# Altium schematic sheet pwrmngmnt.SchDoc
size A3; SheetNumber: 1; SheetTotal: 2
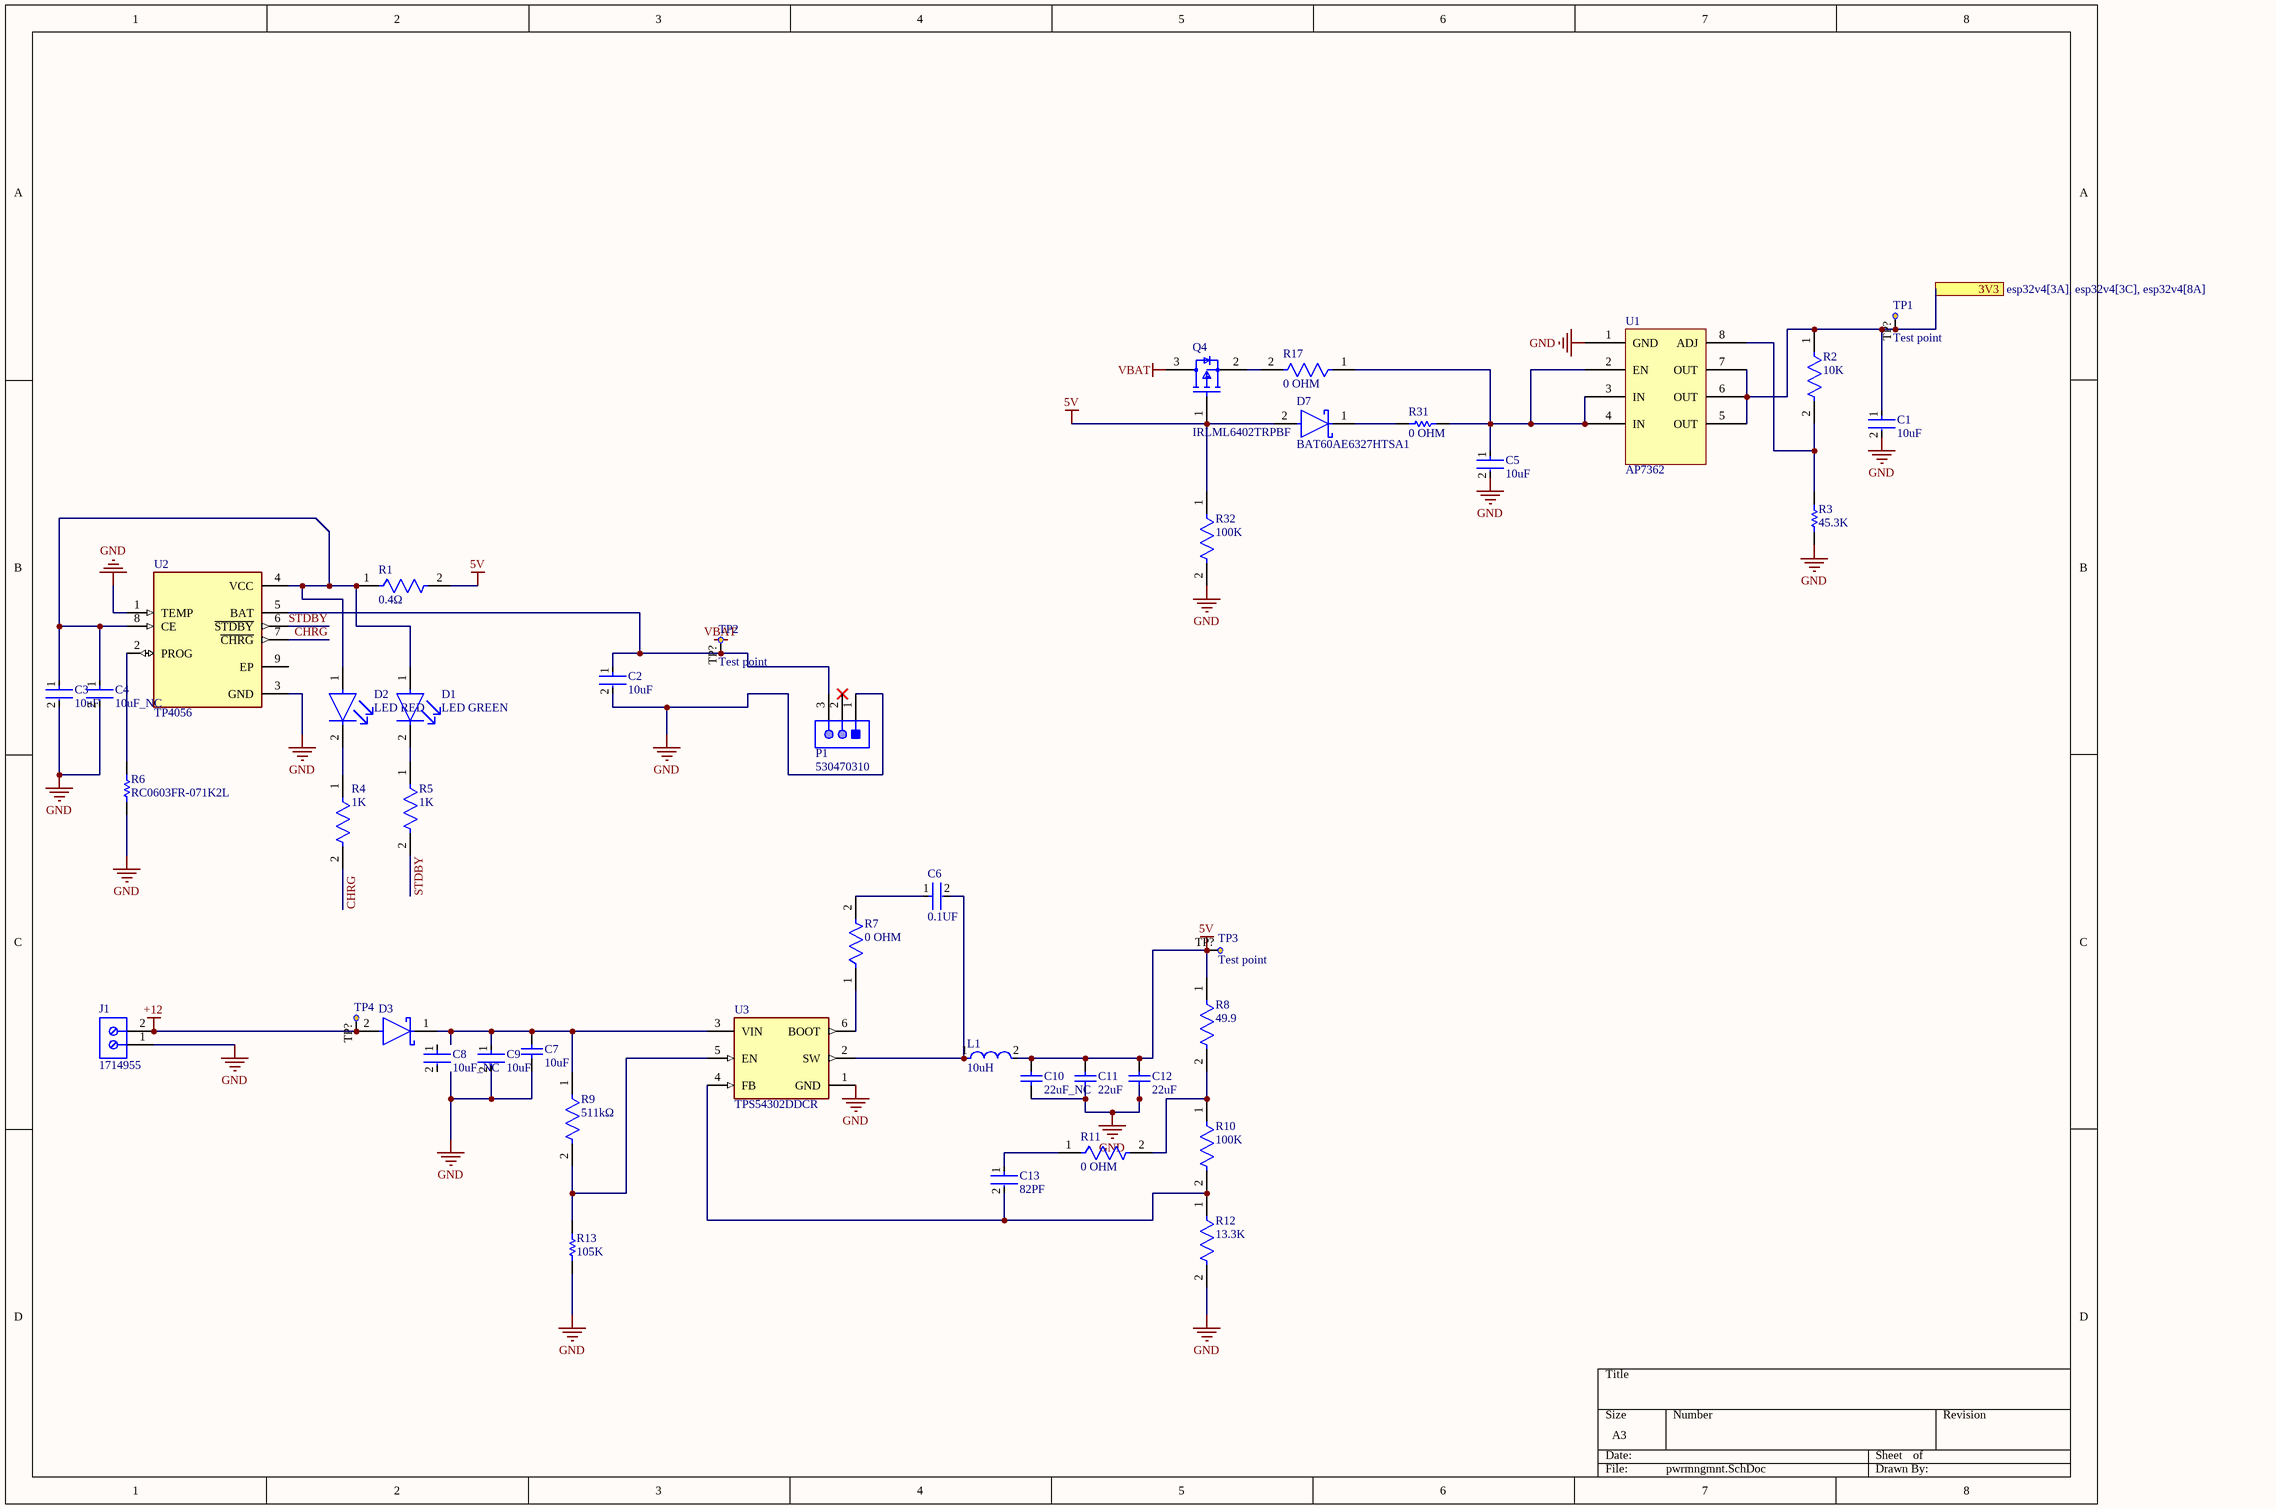
[diagram p0: pwrmngmnt.SchDoc]

## Parts
C1  10uF  [FP-GRM21B-0_1-IPC_C]
C2  10uF  [FP-1210-L_3_3_0_4-W_2_5_0-IPC_B]
C3  10uF  [FP-GRM21B-0_1-IPC_C]
C4  10uF_NC  [FP-GRM21B-0_1-IPC_C]
C5  10uF  [FP-GRM21B-0_1-IPC_C]
C6  0.1UF  [FP-CC0805-0_85-MFG]
C7  10uF  [CAPC1210(3225)280_L]
C8  10uF_NC  [FP-GRM21B-0_1-IPC_C]
C9  10uF  [FP-GRM21B-0_1-IPC_C]
C10  22uF_NC  [CAPC1210(3225)230_L]
C11  22uF  [CAPC1210(3225)230_L]
C12  22uF  [CAPC1210(3225)230_L]
C13  82PF  [FP-C0603C-CF-MFG]
D1  LED GREEN  [FP-APT2012MGC-MFG]
D2  LED RED  [FP-AP2012EC-MFG]
D3  SS34-E3/57T  [FP-95402-MFG]  (value not drawn)
D7  BAT60AE6327HTSA1  [FP-PG-SOD323-2-IPC_C]
J1  1714955  [PHOE-1714955_V]
L1  10uH  [FP-CB3225-IPC_A]
P1  530470310  [MOLX-530470310_V]
Q4  IRLML6402TRPBF  [FP-Micro3-MFG]
R1  0.4Ω  [FP-CSR1206-IPC_C]
R2  10K  [FP-RT0603-MFG]
R3  45.3K  [RESC2013X60X35NL10T20]
R4  1K  [FP-RT0603-MFG]
R5  1K  [FP-RT0603-MFG]
R6  RC0603FR-071K2L  [RESC1608X55X25LL10T15]
R7  0 OHM  [FP-RMCF0805-MFG]
R8  49.9  [FP-CPF0603-MFG]
R9  511kΩ  [FP-CRCW0805-e3-IPC_B]
R10  100K  [FP-RT0402-MFG]
R11  0 OHM  [FP-RMCF0805-MFG]
R12  13.3K  [FP-ERJ3EK-MFG]
R13  105K  [RESC2013X60X35LL10T20]
R17  0 OHM  [FP-RMCF0805-MFG]
R31  0 OHM  [RESC1608X55X25ML10T15]
R32  100K  [FP-RT0402-MFG]
TP1  Test point  [Test_Point]
TP2  Test point  [Test_Point]
TP3  Test point  [Test_Point]
TP4  Test point  [Test_Point]  (value not drawn)
U1  AP7362  [SOIC127P600X163-9N]
U2  TP4056  [SOP127P600X175-9N]
U3  TPS54302DDCR  [FP-DDC0006A-MFG]

## Ports
3V3 (see esp32v4[3A], esp32v4[3C], esp32v4[8A])

## Nets
5V: C10.1 C11.1 C12.1 D7.2(A) L1.2 Q4.1(G) R1.2 R8.1 R32.1 TP3.TP?(Test_point)
+12: D3.2(A) J1.2 TP4.TP?(Test_point)
GND: C1.2 C2.2 C3.2 C4.2 C5.2 C7.2 C9.2 C10.2 C11.2 C12.2 J1.1 P1.1 R3.2 R6.2 R12.2 R13.1 R32.2 U1.1(GND) U2.1(TEMP) U2.3(GND) U3.1(GND)
VBAT: C2.1 P1.3 Q4.3(D) TP2.TP?(Test_point) U2.5(BAT)
3V3: C1.1 R2.1 TP1.TP?(Test_point) U1.5(OUT) U1.6(OUT) U1.7(OUT) ; port 3V3
CHRG: R4.2 U2.7(~{CHRG})
STDBY: R5.2 U2.6(~{STDBY})
NetC3_1: C3.1 C4.1 D1.1(A) D2.1(A) R1.1 U2.4(VCC) U2.8(CE)
NetC5_1: C5.1 R17.1 R31.2 U1.2(EN) U1.3(IN) U1.4(IN)
NetC6_1: C6.1 R7.2
NetC6_2: C6.2 L1.1 U3.2(SW)
NetC7_1: C7.1 C9.1 D3.1(C) R9.1 U3.3(VIN)
NetC13_1: C13.1 R11.1
NetC13_2: C13.2 R10.2 R12.1 U3.4(FB)
NetD1_2: D1.2(C) R5.1
NetD2_2: D2.2(C) R4.1
NetD7_1: D7.1(C) R31.1
NetQ4_2: Q4.2(S) R17.2
NetR2_2: R2.2 R3.1 U1.8(ADJ)
NetR6_1: R6.1 U2.2(PROG)
NetR7_1: R7.1 U3.6(BOOT)
NetR8_2: R8.2 R10.1 R11.2
NetR9_2: R9.2 R13.2 U3.5(EN)

Not connected (* = marked no-connect by the designer): C8 1 2; P1 2*; U2 9(EP)

## Library data of the parts
C1 C3-C5 C8 C9 = CMP-2007-03453-2: Chip Multilayer Ceramic Capacitors for General Purpose, 0805, 10uF, X5R, 15%, 10%, 16V; Radiation Hardening: No; Thickness: 0.053inch; Voltage Rating (DC): 16V; Lead Free: Lead Free; Package Quantity: 1; Width: 1.25mm; Case Code (Imperial): 0805; Depth: 1.25mm; Packaging: Tape and Reel; Dielectric: X5R; Max Operating Temperature: 85°C; Tolerance: 10%; Voltage Rating: 16V; Voltage: 16V; Capacitance: 10uF; Height: 1.25mm; Case Code (Metric): 2012; Material: Ceramic; Mount: Surface Mount; Case/Package: 0805; REACH SVHC: No SVHC; Length: 2mm; Min Operating Temperature: -55°C; Termination: SMD/SMT; Value: 10uF
C2 = CMP-2000-05480-2: General Purpose Ceramic Capacitor, 1210, 10uF, 10%, X7R, 15%, 50V; Thickness: 0.11inch; Capacitance: 10uF; Case Code (Imperial): 1210; Case/Package: 1210; Max Operating Temperature: 125°C; Series: -; Tolerance: 10%; Packaging: Tape and Reel; Voltage Rating: 50V; Termination: SMD/SMT; RoHS Compliant: Yes; Min Operating Temperature: -55°C; Length: 3.2mm; Lead Free: Lead Free; Voltage: 50V; REACH SVHC: No SVHC; Package Quantity: 1000; Dielectric: X7R; Depth: 2.5mm; Case Code (Metric): 3225; Voltage Rating (DC): 50V; Width: 0.098inch; Contact Plating: Tin; Mount: Surface Mount; Value: 10uF
C6 = CMP-2100-03606-3: CAP CER 0.1UF 50V X7R 0805; Manufacturer Part Number: CC0805KRX7R9BB104; Manufacturer: Yageo; Tolerance: 0.1; Capacitance: 100 nF; Value: 100 nF; Material: Ceramic; Device Class L1: Passive Components; ComponentLink2Description: Datasheet; Package: CC0805-0.85; Digikey Description: CAP CER 0.1UF 50V X7R 0805; Device Class L3: Ceramic Capacitors; Temperature: -30°C to +85°C; Temperature Characteristic: X7R; Voltage Rating: 50 V; Height: 0.95mm; RoHS: TRUE; Ipc Land Pattern Name: CAPC200125X85; Device Class L2: Capacitors; Category: Cap; Temperature Range Low: -30°C; Temperature Range High: +85°C; Mouser Description: Multilayer Ceramic Capacitors MLCC - SMD/SMT 100nF 50V X7R 10%; Footprint Url: http://www.yageo.com/exep/pages/download/literatures/UPY-C_GEN_24.pdf; Automotive: No; Octopart: https://octopart.com/cc0805krx7r9bb104-yageo-192993; Lead Free: Yes; ComponentLink2URL: http://www.yageo.com/documents/recent/UPY-GPHC_Y5V_6.3V-to-50V_8.pdf
C7 = CMP-1038-02227-2: CAP 10uF 25V ±10% 1210 (3225 Metric) Thickness 2.8mm SMD; Case-EIA: 1210; Tolerance: Â±10%; Case-Metric: 3225; Value: 10uF; Max Thickness: 2.8 mm; Technology: SMT; Rated Voltage: 25 V
C10-C12 = CMP-1038-02281-3: CAP 22uF 16V -20% to +80% 1210 (3225 Metric) Thickness 2.2mm SMD; Case-EIA: 1210; Case-Metric: 3225; Rated Voltage: 16 V; Technology: SMT; Tolerance: -20% to +80%; Max Thickness: 2.2 mm; Value: 22uF
C13 = CMP-2006-03274-2: CAP CER 82PF 50V C0G/NP0 0603; Manufacturer Part Number: C0603C820J5GACTU; Manufacturer: KEMET; Temperature Coefficient: 30ppm/°C; Tolerance: 0.05; Material: Ceramic; Temperature Characteristic: C0G; Automotive Grade: Grade 1; Temperature Range High: +125°C; Voltage Rating: 50 V; Device Class L3: Ceramic Capacitors; Category: Cap; Temperature Range Low: -55°C; Temperature: -55°C to +125°C; Package: C0603C-CF; Height: 0.87mm; Digikey Description: CAP CER 82PF 50V C0G/NP0 0603; Automotive: Yes; Capacitance: 82 pF; ComponentLink2URL: https://api.kemet.com/component-edge/download/datasheet/C0603C100J5GACAUTO.pdf; Value: 82 pF; Octopart: https://octopart.com/c0603c820j5gactu-kemet-96229; RoHS: TRUE; Device Class L2: Capacitors; Mouser Description: Multilayer Ceramic Capacitors MLCC - SMD/SMT 50volts 82pF C0G 5%; Lead Free: Yes; ComponentLink2Description: Datasheet; Device Class L1: Passive Components
D1 = CMP-44529-000017-1: LED GREEN CLEAR CHIP SMD; Power Rating: 75mW; Lens Color: Colorless; Luminous Intensity: 70mcd; Forward Current: 20mA; Dominant Wavelength: 570nm; Viewing Angle: 120°; Forward Voltage: 2.1V; Package Quantity: 2000; Color: Green; Length: 2mm; Lead Free: Lead Free; Min Operating Temperature: -40°C; Illumination Color: Green; Case/Package: 0805; Width: 1.25mm; Test Current: 20mA; Max Operating Temperature: 85°C; Case Code (Imperial): 0805; Mount: Surface Mount; Lens Style: Clear; Height: 0.75mm; Case Code (Metric): 2012; Packaging: Tape and Reel; Lens Transparency: Clear
D2 = CMP-44529-000070-1: LED RED CLEAR SMD; Forward Voltage: 2V; Test Current: 20mA; Luminous Intensity: 15mcd; Viewing Angle: 120°; Wavelength: 627nm; Dominant Wavelength: 625nm; Lead Free: Lead Free; Length: 2mm; Forward Current: 20mA; Mount: Surface Mount; Packaging: Tape and Reel; Illumination Color: Red; Color: Red; Height: 1.1mm; Case Code (Metric): 2012; Case Code (Imperial): 0805; Case/Package: 0805; Width: 1.25mm; RoHS Compliant: Yes; Package Quantity: 2000; Min Operating Temperature: -40°C; Max Operating Temperature: 85°C; Lens Style: Clear
D3 = CMP-02539-000012-1: DIODE SCHOTTKY 40V 3A DO214AB; Manufacturer: Vishay; Max Junction Temp: +150°C; Peak Reverse Current: 0.5mA; Max Surge Forward Current: 100A; Standoff Height: 0mm; ComponentLink2Description: Datasheet; Device Class L3: Schottky Diodes; Height: 2.62mm; Max Repetitive Reverse Voltage: 40V; Lead Free: Yes; Package: 95402; Temperature Range High: +150°C; ComponentLink2URL: http://www.vishay.com/docs/88751/ss32.pdf; Temperature: -55°C to +150°C; Footprint Url: http://www.vishay.com/docs/95402/smc.pdf; Automotive: No; Forward Current: 3A; Category: Diode; Manufacturer Part Number: SS34-E3/57T; RoHS: TRUE; Device Class L2: Diodes; Mouser Description: Schottky Diodes & Rectifiers 3.0 Amp 40 Volt; Octopart: https://octopart.com/ss34-e3%2F57t-vishay-39552907; Temperature Range Low: -55°C; Device Class L1: Discrete Semiconductors; Digikey Description: DIODE SCHOTTKY 40V 3A DO214AB
D7 = CMP-32890-000004-1: DIODE SCHOTTKY 10V 3A SOD323-2; Forward Voltage: 370mV; Polarity: Standard; Peak Non-Repetitive Surge Current: 5A; Element Configuration: Single; Max Operating Temperature: 85°C; Current Rating: 3A; Number of Pins: 2; Mount: Surface Mount; Forward Current: 3A; Max Reverse Voltage (DC): 10V; Output Current: 3A; Contact Plating: Tin; Average Rectified Current: 3A; Lead Free: Lead Free; Max Repetitive Reverse Voltage (Vrrm): 10V; Voltage Rating (DC): 10V; Radiation Hardening: No; Halogen Free: Not Halogen Free; Case/Package: SOD-323-2; REACH SVHC: No SVHC; Min Operating Temperature: -55°C; Packaging: Tape and Reel
J1 = CMP-2000-05797-1: PC Terminal Block, Pitch 6.35 mm, 1 x 2 Position, Height 21.5 mm, Tail Lenght 5.1 mm, RoHS, Bulk; Manufacturer: Phoenix Contact; Package Description: PC Terminal Block, Pitch 6.35 mm, 1 x 2 Position, Height 21.5 mm, Tail Lenght 5.1 mm; Datasheet URL: http://media.digikey.com/pdf/Data%20Sheets/Phoenix%20Contact%20PDFs/1714955.pdf; Package Reference: 1714955; Manufacturer URL: http://www.phoenixcontact.com/; Datasheet Version: 02/2010; Mounting Technology: ThroughHole
L1 = CMP-14484-000123-1: SMD Inductors 10uH ±20% 0.9A 0.1729Ω 1210; Shielding: Unshielded; DC Resistance (DCR): 172.9mR; Core Material: Ferrite; Self Resonant Frequency: 23MHz; Max DC Current: 900mA; Test Frequency: 100kHz; Package Quantity: 1000; Military Standard: Not; Inductance: 10uH; Height: 2.5mm; Case Code (Metric): 3225; Width: 0.098inch; Case Code (Imperial): 1210; Inductance Tolerance: 20%; Lead Free: Lead Free; Length: 3.4mm; Max Operating Temperature: 105°C; Resistor Type: Wirewound; Height - Seated (Max): 0.106inch; Series: CB; Packaging: Tape and Reel; Depth: 2.7mm; Number of Pins: 2; Radiation Hardening: No; Tolerance: 20%; Case/Package: 1210; Mount: Surface Mount; Saturation Current: 900mA; Min Operating Temperature: -40°C; DC Current: 900mA; Current Rating: 900mA; Halogen Free: Halogen Free; Termination: SMD/SMT; Value: 10uH
P1 = CMP-2000-05465-1: Male Header, Pitch 1.25 mm, 1 x 3 Position, Height 4.2 mm, Tail Length 2.3 mm, -40 to 85 degC, RoHS, Tray; Manufacturer: Molex; Datasheet Version: Rev. E, 11/1994; Mounting Technology: ThroughHole; Package Reference: 530470310; Datasheet URL: http://www.molex.com/pdm_docs/sd/530470310_sd.pdf; Package Description: Male Header, Pitch 1.25 mm, 1 x 3 Position, Height 4.2 mm, Tail Length 2.3 mm; Manufacturer URL: http://www.molex.com/
Q4 = CMP-32901-000130-1: MOSFET P-CH 20V 3.7A SOT-23; Manufacturer: Infineon; Reverse Recovery Time: 29ns; Max Forward Diode Voltage: -1.2V; Input Capacitace At Vds: 633pF @ -10V; Drain To Source Resistance: 0.05Ω; Gate To Source Voltage: 12V; Max Junction Temp: +150°C; Pulse Drain Current: -22A; Threshold Vgs Min: -0.4V; Turn Off Delay Time: 588ns; Number Of Channels: 1; Power Dissipation: 1.3W; Turn On Delay Time: 350ns; Drain To Source Breakdown Voltage: -20V; Continuous Drain Current: -3.7A; Depletion Mode: False; Gate Charge At Vgs: 8nC @ -5V; Rthja Max: 75°C/W; Threshold Vgs: -0.55V; Standoff Height: 0.01mm; Reverse Recovery Charge: 11nC; Device Class L2: Transistors; Ipc Land Pattern Name: SOT95P237X100-3; Temperature Range High: +150°C; Octopart: https://octopart.com/irlml6402trpbf-infineon-65874989; ComponentLink2URL: https://www.infineon.com/dgdl/irlml6402pbf.pdf?fileId=5546d462533600a401535668d5c2263c; Automotive: No; Manufacturer Part Number: IRLML6402TRPBF; Height: 1.12mm; Drain To Source Voltage: -20V; Digikey Description: MOSFET P-CH 20V 3.7A SOT-23; Device Class L1: Discrete Semiconductors; Package: Micro3; Lead Free: Yes; Temperature Range Low: -55°C; Number Of P Channels: 1; Technology: MOSFET; Temperature: -55°C to +150°C; Category: Trans; Footprint Url: http://irf.com/package/outline/po_micro3.pdf; RoHS: TRUE; Device Class L3: MOSFETs; Threshold Vgs Max: -1.2V; ComponentLink2Description: Datasheet
R1 = CMP-26527-004884-1: General Purpose Thick Film Chip Resistor, 1206, 0.4Ω, 5%, 100ppm/°C, 0.5W; Min Operating Temperature: -55°C; RoHS Compliant: Yes; Tolerance: 5%; Max Operating Temperature: 155°C; Mount: Surface Mount; Packaging: Tape and Reel
R2 = CMP-03412-005349-1: RES SMD 10K OHM 1% 1/10W 0603; Manufacturer: Yageo; Manufacturer Part Number: RT0603FRE0710KL; Value: 10KΩ; Temperature Coefficient: 50 ppm/°C; Power Rating: 0.1W; Tolerance: 0.01; Voltage Rating: 75V; RoHS: TRUE; Category: Res; Automotive: No; Digikey Description: RES SMD 10K OHM 1% 1/10W 0603; ComponentLink2Description: Datasheet; Octopart: https://octopart.com/rt0603fre0710kl-yageo-40009243; ComponentLink2URL: http://www.yageo.com/documents/recent/PYu-RT_1-to-0.01_RoHS_L_9.pdf; Device Class L3: Chip SMD Resistors; Device Class L1: Passive Components; Temperature Range High: +155°C; Height: 0.55mm; Composition: Thin Film; Ipc Land Pattern Name: RESC16080X45; Series: RT; Package: RT0603; Resistance: 10KΩ; Footprint Url: http://www.yageo.com/exep/pages/download/literatures/PYu-R_Mount_10.pdf; Temperature: -55°C to +155°C; Temperature Range Low: -55°C; Lead Free: Yes; Device Class L2: Resistors; Mouser Description: Thin Film Resistors - SMD 10K ohm 1% 1/10W
R3 = CMP-1013-00697-2: Part Number: RC0805FR-0745K3L; Manufacturer: Yageo
R4 R5 = CMP-03412-013082-1: RES SMD 1K OHM 0.1% 1/10W 0603; Manufacturer Part Number: RT0603BRD071KL; Manufacturer: Yageo; Voltage Rating: 75V; Temperature Coefficient: 25ppm/°C; Value: 1kΩ; Power Rating: 0.1W; Temperature Range Low: -55°C; Series: RT; Digikey Description: RES SMD 1K OHM 0.1% 1/10W 0603; Tolerance: 0.1%; Category: Res; RoHS: TRUE; Composition: Thin Film; ComponentLink2Description: Datasheet; Footprint Url: https://www.yageo.com/upload/website/yageo_PYu-R_Mount_10_19050818_343.pdf; Temperature: -55°C to +155°C; ComponentLink2URL: https://www.yageo.com/upload/media/product/productsearch/datasheet/rchip/PYu-RT_1-to-0.01_RoHS_L_11.pdf; Automotive: No; Octopart: https://octopart.com/rt0603brd071kl-yageo-1433776; Device Class L1: Passive Components; Device Class L2: Resistors; Temperature Range High: +155°C; Height: 0.55mm; Device Class L3: Chip SMD Resistors; Lead Free: Yes; Resistance: 1kΩ; Package: RT0603
R6 = CMP-1659-00042-1: Chip Resistor, 1.2 KOhm, +/- 1%, 0.1 W, -55 to 155 degC, 0603 (1608 Metric), RoHS, Tape and Reel; Resistance: 825 kohm; Voltage Rating: 50 V; Power Rating: 100 mW; Case\Package: 0603; DatasheetVersion: Rev. 4, 02/2016; Package Quantity: 5000; Min Operating Temperature: -55 degC; PackageReference: 0603; ComponentLink1Description: Manufacturer URL; Tolerance: 1%; ComponentLink2Description: Datasheet; Packaging: Tape and Reel; PackageDescription: 2-Pin Surface Mount Device, Body 1.6 x 0.8 mm; Width: 0.8 mm; ComponentLink2URL: http://www.yageo.com/documents/recent/PYu-RC_Group_51_RoHS_L_04.pdf; ComponentLink1URL: http://www.yageo.com/; Max Operating Temperature: 155 degC; RoHSCompliant: true; Height: 0.45 mm; Case Code (Imperial): 0603; Case Code (Metric): 1608; Length: 1.6 mm
R7 R11 R17 = CMP-26527-000017-1: RES 0 OHM JUMPER 1/8W 0805; Power Rating: 125mW; Resistance: 0mR; Depth: 1.25mm; Length: 2mm; Military Standard: Not; Width: 0.049inch; Case Code (Imperial): 0805; Number of Terminations: 2; Mount: Surface Mount; Contact Plating: Tin; Height: 0.026inch; Case/Package: 0805; Min Operating Temperature: -55°C; Composition: Thick Film; Max Operating Temperature: 155°C; Packaging: Tape and Reel; Features: Automotive AEC-Q200; Max Power Dissipation: 125mW; Radiation Hardening: No; Lead Free: Lead Free; Case Code (Metric): 2012
R8 = CMP-03211-000514-1: RES SMD 49.9Ω 1% 1/16W 0603; Manufacturer Part Number: CPF0603F49R9C1; Manufacturer: TE Connectivity; Power Rating: 0.063W; Temperature Coefficient: 50ppm/°C; Voltage Rating: 50V; Tolerance: 1%; Category: Res; Octopart: https://octopart.com/cpf0603f49r9c1-te+connectivity-42012738; Lead Free: Yes; Package: CPF0603; packaging: 1k Reel; Resistance: 49.9Ω; Device Class L1: Passive Components; octopart_url: https://octopart.com/cpf0603f49r9c1-te+connectivity-42012738; Temperature Range High: +155°C; RoHS: TRUE; ComponentLink2URL: https://www.te.com/commerce/DocumentDelivery/DDEController?Action=showdoc&DocId=Data+Sheet%7F1773200%7FM%7Fpdf%7FEnglish%7FENG_DS_1773200_M.pdf%7F3-1676481-2; Device Class L3: Chip SMD Resistors; Composition: Thin Film; Value: 49.9Ω; Height: 0.55mm; Automotive: No; Device Class L2: Resistors; Series: CPF; ComponentLink2Description: Datasheet; Temperature: -55°C to +155°C; Temperature Range Low: -55°C; Ipc Land Pattern Name: RESC15580X45
R9 = CMP-2001-03991-2: RES Thick Film, 511kΩ, 1%, 0.125W, 100ppm/°C, 0805; Power Rating: 125mW; Voltage Rating: 150V; Resistance: 511kR; Value: 511kR; Case Code (Metric): 2012; Tolerance: 1%; Technology: THICK FILM; RoHS Compliant: Yes; Size Code: 0805; Length: 2mm; Series: CRCW; Number of Terminations: 2; Radiation Hardening: No; Height: 0.45mm; Construction: Rectangular; Case/Package: 0805; Number of Pins: 2; Depth: 1.25mm; Width: 1.25mm; Case Code (Imperial): 0805; Package Quantity: 10; Contact Plating: Tin; Termination: SMD/SMT; Temperature Coefficient: 100ppm/°C; Military Standard: Not; Min Operating Temperature: -55°C; Resistor Type: Thick Film; Features: Automotive AEC-Q200; Packaging: Tape and Reel; Max Power Dissipation: 125mW; Max Operating Temperature: 155°C; Weight: 0.000194oz; Resistance Tolerance: 1%
R10 R32 = CMP-2002-02911-2: RES 100K OHM 1/16W .1% SMD 0402; Manufacturer Part Number: RT0402BRD07100KL; Manufacturer: Yageo; Temperature Coefficient: 25 ppm/°C; Resistance: 100KΩ; Voltage Rating: 50V; Tolerance: 0.001; Value: 100KΩ; Power Rating: 0.063W; ComponentLink2Description: Datasheet; Temperature: -55°C to +155°C; Automotive: No; Ipc Land Pattern Name: RESC10050X30; Temperature Range Low: -55°C; Package: RT0402; Digikey Description: RES 100K OHM 1/16W .1% SMD 0402; Height: 0.35mm; Footprint Url: http://www.yageo.com/exep/pages/download/literatures/PYu-R_Mount_10.pdf; Temperature Range High: +155°C; Category: Res; Composition: Thin Film; Lead Free: Yes; Octopart: https://octopart.com/rt0402brd07100kl-yageo-1211784; Device Class L1: Passive Components; Device Class L2: Resistors; RoHS: TRUE; ComponentLink2URL: http://www.yageo.com/documents/recent/PYu-RT_1-to-0.01_RoHS_L_9.pdf; Device Class L3: Chip SMD Resistors; Series: RT; Mouser Description: Thin Film Resistors - SMD 1/16W 100K ohm .1% 25ppm
R12 = CMP-2000-00238-2: NexarPartId: 55421458; Max Power Dissipation: 100mW; Temperature Coefficient: 100ppm/°C; Voltage Rating: 75V; Voltage Rating (DC): 50V; Resistance: 13.3kΩ; Tolerance: 1%; Number of Terminations: 2; Depth: 800µm; Termination: SMD/SMT; Lifecycle Status: Production; Max Operating Temperature: 155°C; Case Code (Imperial): 0603; Width: 800µm; Length: 1.6mm; Features: Automotive AEC-Q200; Lead Free: Lead Free; RoHS: Compliant; Schedule B: 8533210045, 8533210045; Min Operating Temperature: -55°C; Case/Package: 0603; Mount: Surface Mount; Military Standard: Not; Case Code (Metric): 1608; Contact Plating: Tin; Power Rating: 100mW; REACH SVHC: No SVHC; Height: 558.8µm; Packaging: Cut Tape; Composition: Thick Film
R13 = CMP-2001-04571-1: Part Number: RC0805FR-07105KL; Manufacturer: Yageo
R31 = CMP-2100-03667-1: Chip Resistor, 0 Ohm, +/- 5%, 0.1 W, -55 to 155 degC, 0603 (1608 Metric), RoHS, Tape and Reel; Manufacturer: Yageo; Temperature Coefficient: 200ppm/degreesC; Voltage Rating: 50V; Power Rating: 100mW; Resistance: 0mOhm; Width: 0.8mm; Max Operating Temperature: 155degC; Tolerance: 5%; Package Reference: 0603; Height: 0.45mm; Depth: 0.8mm; Package Description: 2-Pin Surface Mount Device, Body 1.6 x 0.8 mm; Termination: SMD/SMT; Package Quantity: 5000; Case/Package: 0603; Case Code (Imperial): 0603; Radiation Hardening: No; Number of Pins: 2; Length: 1.6mm; Lead Free: LeadFree; Voltage Rating (DC): 50V; Military Standard: Not; Datasheet URL: http://www.yageo.com/NewPortal/yageodocoutput?fileName=/pdf/R-Chip/PYu-RC_Group_51_RoHS_L_5.pdf; Manufacturer URL: http://www.yageo.com/; Packaging: TapeandReel; Case Code (Metric): 1608; Min Operating Temperature: -55degC; Composition: ThickFilm; RoHSCompliant: true; Contact Plating: Tin; Datasheet Version: Rev. 5, 10/2016; REACH SVHC: NoSVHC
TP1-TP4 = Test_Point: Value: Test point
U1 = Component_1
U2 = TP4056: Complete single cell Li-Ion battery with a constant current / constant voltage linear charger; MF: NanJing Top Power ASIC Corp.; Check_prices: https://www.snapeda.com/parts/TP4056/NanJing+Top+Power+ASIC+Corp./view-part/?ref=eda; SnapEDA_Link: https://www.snapeda.com/parts/TP4056/NanJing+Top+Power+ASIC+Corp./view-part/?ref=snap; Price: None; Availability: Not in stock; Package: Package; MP: TP4056; Value: *
U3 = CMP-04918-000032-1: IC REG BUCK ADJ 3A TSOT23-6; Manufacturer: Texas Instruments; Output Voltage: 0.6-26V; Output Type: AdjustableProgrammable; Max Junction Temp: +125°C; Number Of Outputs: 1; Min Supply Voltage: 4.5V; Switching Frequency: 400kHz; Standoff Height: 0mm; Max Duty Cycle: 100%; Nominal Supply Current: 45uA; Max Supply Voltage: 28V; Temperature Range High: +125°C; Switching Topology: Buck; Device Class L2: Power Management ICs; Output Current: 3A; Automotive: No; Temperature Range Low: -40°C; Temperature: -40°C to +125°C; Height: 1.1mm; Ipc Land Pattern Name: SOT95P280X110-6; RoHS: TRUE; Digikey Description: IC REG BUCK ADJ 3A TSOT23-6; Manufacturer Part Number: TPS54302DDCR; ComponentLink2Description: Datasheet; Device Class L3: Voltage Regulators - Switching; Octopart: https://octopart.com/tps54302ddcr-texas+instruments-74209025; Device Class L1: Integrated Circuits (ICs); Lead Free: Yes; ComponentLink2URL: http://www.ti.com/lit/ds/symlink/tps54302.pdf; Category: IC; Package: DDC0006A